# Altium schematic sheet mixer.SchDoc
size A; SheetNumber: 5; SheetTotal: 9
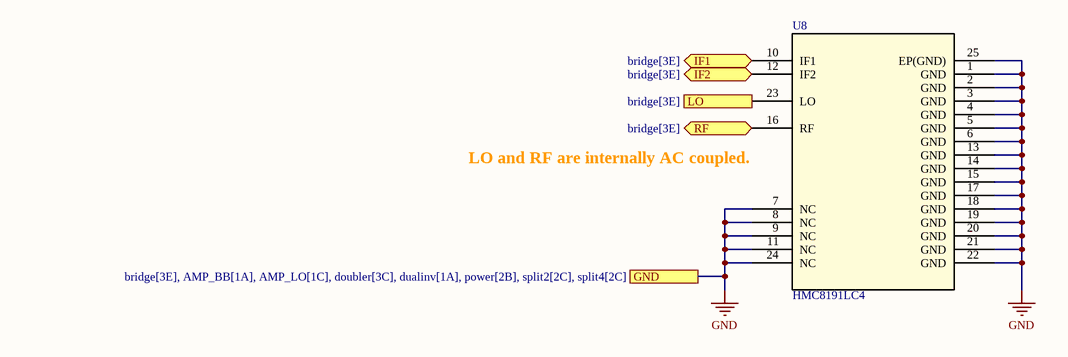
[diagram p0: mixer.SchDoc]

## Parts
U8  HMC8191LC4  [HMC8191_E-24-1]

## Ports
GND (see bridge[3E], AMP_BB[1A], AMP_LO[1C], doubler[3C], dualinv[1A], power[2B], split2[2C], split4[2C]), IF1 (bidir, see bridge[3E]), IF2 (bidir, see bridge[3E]), LO (in, see bridge[3E]), RF (bidir, see bridge[3E])

## Nets
GND: U8.1(GND) U8.2(GND) U8.3(GND) U8.4(GND) U8.5(GND) U8.6(GND) U8.7(NC) U8.8(NC) U8.9(NC) U8.11(NC) U8.13(GND) U8.14(GND) U8.15(GND) U8.17(GND) U8.18(GND) U8.19(GND) U8.20(GND) U8.21(GND) U8.22(GND) U8.24(NC) U8.25(EP(GND)) ; port GND
IF1: U8.10(IF1) ; port IF1
IF2: U8.12(IF2) ; port IF2
LO: U8.23(LO) ; port LO
RF: U8.16(RF) ; port RF

## Notes on the sheet
- (near U8) LO and RF are internally AC coupled.

## Library data of the parts
U8 = HMC8191LC4: 6 GHz to 26.5 GHz, / Wideband I/Q Mixer; Manufacturer: Analog Devices; RefDes: RefDes; Supplier 1: Mouser; Supplier Part Number 1: 584-HMC8191LC4; Part Number: HMC8191LC4